# EAGLE design Motor_board_2_5 (EAGLE 9.0.0)
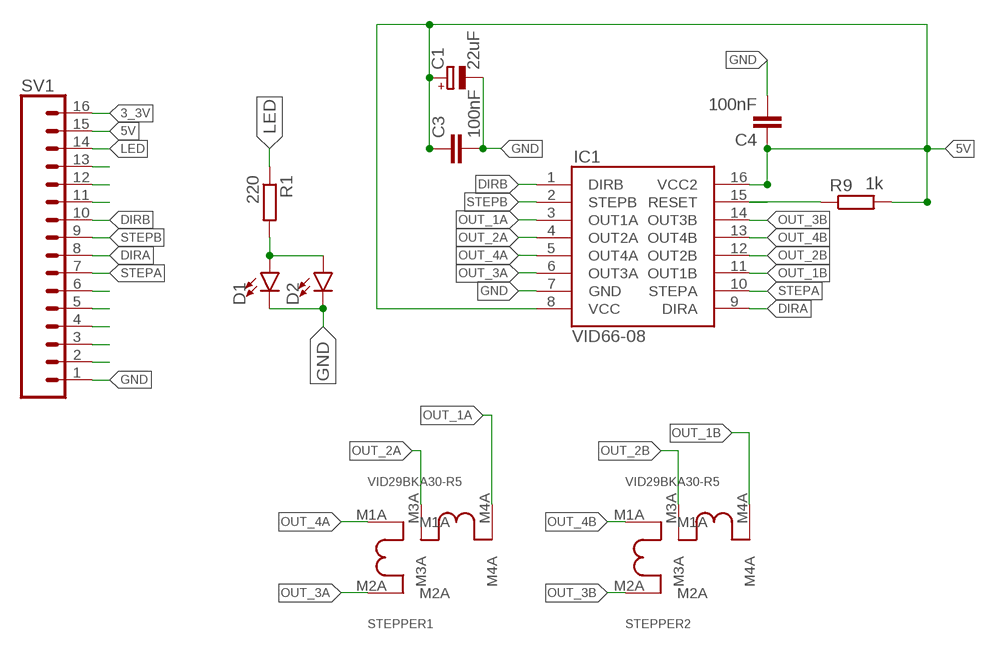
[diagram p0: schematic, sheet 1]

## Parts
C1  22uF  CPOL-EU153CLV-0605  [153CLV-0605]
C3  100nF  C-EUC1206K  [C1206K]
C4  100nF  C-EUC1206K  [C1206K]
D1  LED-3MM-NO_SILK  [LED_3MM-NS]
D2  LED-3MM-NO_SILK  [LED_3MM-NS]
IC1  VID66-08  [SO16]
R1  220  R-EU_0204/7  [0204/7]
R9  1k  R-EU_M0805  [M0805]
STEPPER1  VID29BKA30-R5  [BKA30-R5]
STEPPER2  VID29BKA30-R5  [BKA30-R5]
SV1  CONN_16  [1X16]

## Nets
3_3V: SV1.16
5V [5V]: C1.+ C3.1 C4.1 IC1.8(VCC) IC1.16(VCC2) R9.2 SV1.15
DIRA: IC1.9(DIRA) SV1.8
DIRB: IC1.1(DIRB) SV1.10
GND [GND]: C1.- C3.2 C4.2 D1.K(C) D2.K(C) IC1.7(GND) SV1.1
LED [LED]: R1.1 SV1.14
N$1: D1.A D2.A R1.2
N$4: SV1.3
N$5: SV1.2
N$6: SV1.11
N$7: SV1.12
N$8: SV1.13
N$9: SV1.5
N$10: SV1.4
N$11: SV1.6
N$15: IC1.15(RESET) R9.1
OUT_1A: IC1.3(OUT1A) STEPPER1.M4A
OUT_1B: IC1.11(OUT1B) STEPPER2.M4A
OUT_2A: IC1.4(OUT2A) STEPPER1.M3A
OUT_2B: IC1.12(OUT2B) STEPPER2.M3A
OUT_3A: IC1.6(OUT3A) STEPPER1.M2A
OUT_3B: IC1.14(OUT3B) STEPPER2.M2A
OUT_4A: IC1.5(OUT4A) STEPPER1.M1A
OUT_4B: IC1.13(OUT4B) STEPPER2.M1A
STEPA: IC1.10(STEPA) SV1.7
STEPB: IC1.2(STEPB) SV1.9

## Library data of the parts
C1 = rcl:CPOL-EU: POLARIZED CAPACITOR, European symbol; SPICEPREFIX: C
C3 C4 = rcl:C-EU: CAPACITOR, European symbol; SPICEPREFIX: C
D1 D2 = SparkFun-LED:LED: LED (Generic) Standard schematic elements and footprints for 5mm, 3mm, 1206, and 0603 sized LEDs. Generic LEDs with no color specified.
IC1 = Franks:VID66-08
R1 R9 = resistor:R-EU_: RESISTOR, European symbol
STEPPER1 STEPPER2 = Franks:VID29
SV1 = SparkFun-Connectors:CONN_16: Multi connection point. Often used as Generic Header-pin footprint for 0.1 inch spaced/style header connections On any of the 0.1 inch spaced packages, you can populate with these: Break Away Headers - Straight <https://www.sparkfun.com/products/116> (PRT-00116) Break Away Male Headers - Right Angle <https://www.sparkfun.com/products/553> (PRT-00553) Female Headers <https://www.sparkfun.com/products/115> (PRT-00115) Break Away Headers - Machine Pin <https://www.sparkfun.com/products/117> (PRT-00117) Break Away Female Headers - Swiss Machine Pin <https://www.sparkfun.com/products/743> (PRT-00743) For SCREWTERMINALS and SPRING TERMINALS visit here: Screw Terimnals on SparkFun.com <https://www.sparkfun.com/search/results?term=Screw+Terminals> (5mm/3.5mm/2.54mm spacing) This device is also useful as a general connection point to wire up your design to another part of your project. Our various solder wires solder well into these plated through hole pads. Hook-Up Wire - Assortment (Stranded, 22 AWG) <https://www.sparkfun.com/products/11375> (PRT-11375) Hook-Up Wire - Assortment (Solid Core, 22 AWG) <https://www.sparkfun.com/products/11367> (PRT-11367) View the entire wire category on our website here <https://www.sparkfun.com/categories/141> Special notes: Molex polarized connector foot print use with SKU : PRT-08231 with associated crimp pins and housings. 1MM SMD Version SKU: PRT-10208 NOTES ON THE VARIANTS LOCK and LOCK_LONGPADS... This footprint was designed to help hold the alignment of a through-hole component (i.e. 6-pin header) while soldering it into place. You may notice that each hole has been shifted either up or down by 0.005 of an inch from it's more standard position (which is a perfectly straight line). This slight alteration caused the pins (the squares in the middle) to touch the edges of the holes. Because they are alternating, it causes a "brace" to hold the component in place. 0.005 has proven to be the perfect amount of "off-center" position when using our standard breakaway headers. Although looks a little odd when you look at the bare footprint, once you have a header in there, the alteration is very hard to notice. Also,if you push a header all the way into place, it is covered up entirely on the bottom side.

## Net classes
0 default: width 0.203 mm
1 GND: width 0.762 mm, clearance 0.254 mm
3 LED: width 0.508 mm
4 5V: width 0.508 mm

## Board
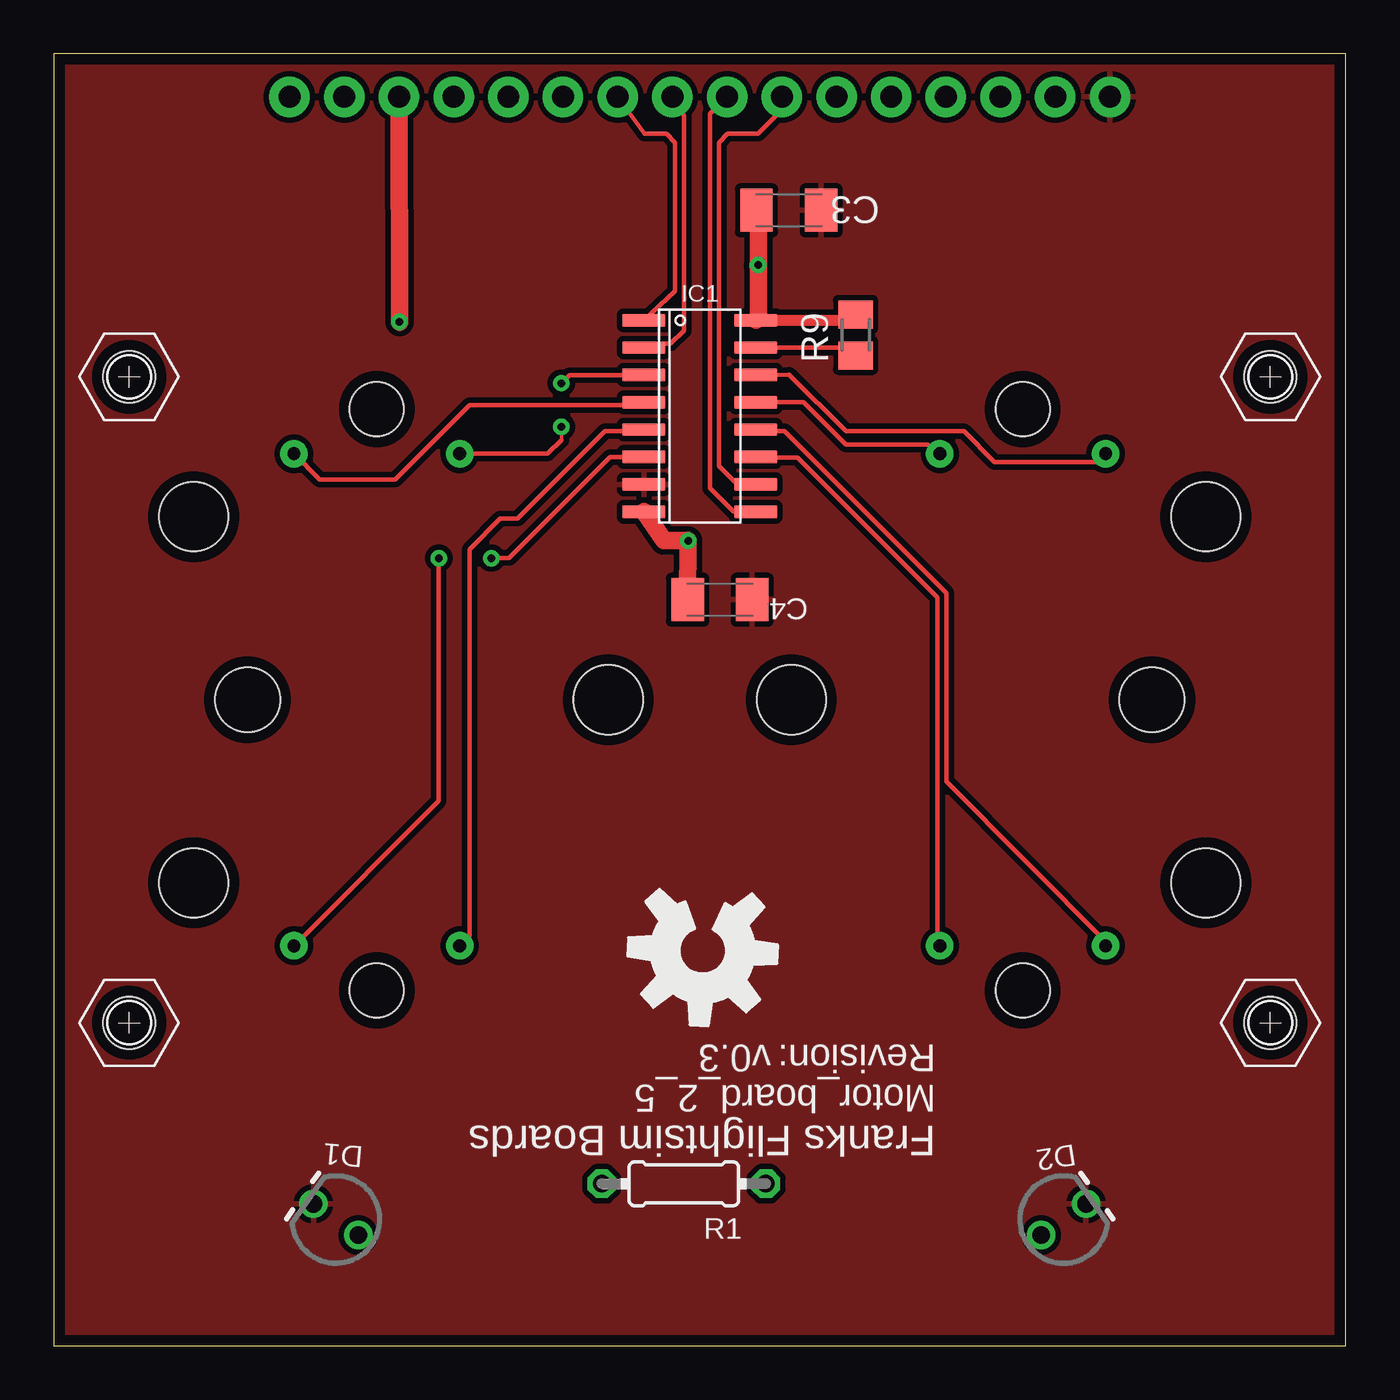
[diagram p1: board, top side]
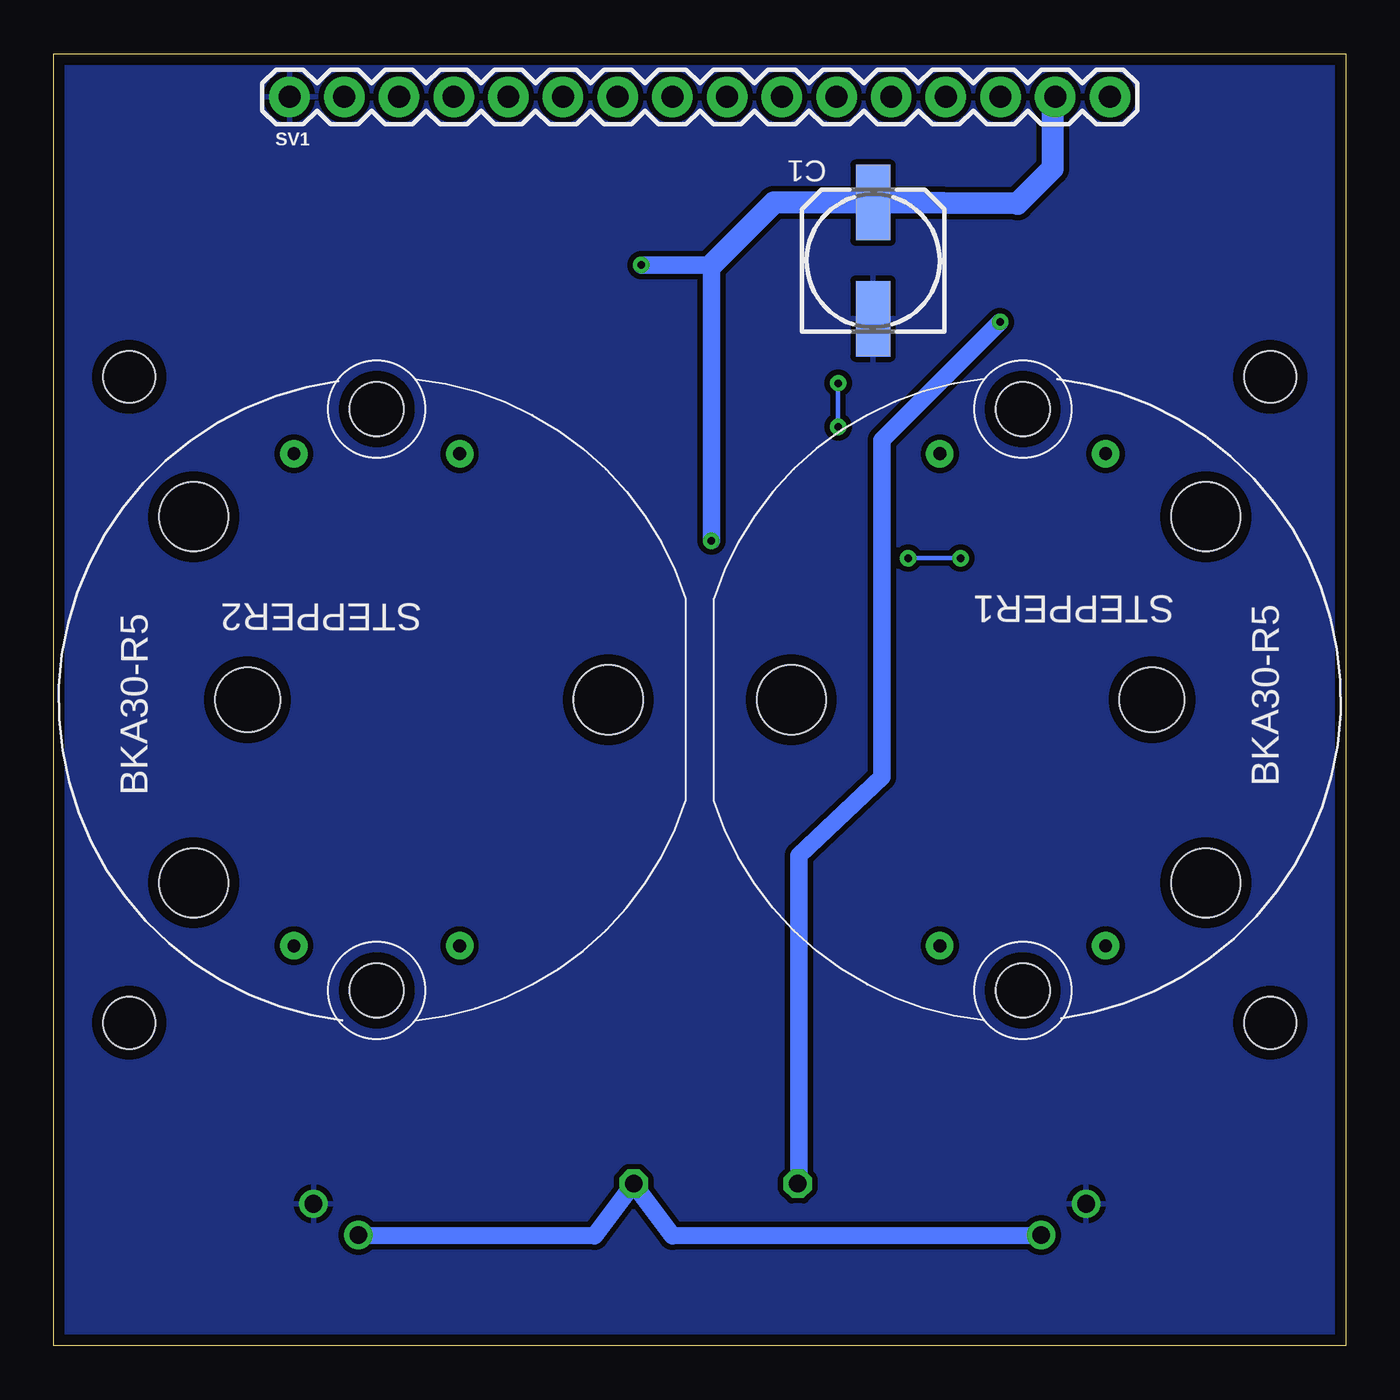
[diagram p2: board, bottom side, seen from below]

Size 60 x 60 mm. Coordinates in mm from the lower left corner, seen from the top.
Outline: 0,0 60,0 60,60 0,60 0,0
Copper layers (1*16): Top 0.035mm / dielectric 1.5mm / Bottom 0.035mm
Design rules "default *": minimum track width 6mil, minimum drill 0.35mm, track to track 6mil, track to pad 6mil, pad to pad 6mil, via to via 6mil, smd to smd 6mil, copper to edge 20mil, drill to drill 6mil, minimum pad ring 10mil, minimum via ring 8mil, stop-mask expansion 4mil, vias tented up to drill 0mil, thermal gap 10mil

### Footprints (pad centres in the part's own frame; a part is rotated, then mirrored left to right if it is on the bottom)
153CLV-0605 = smd 3.5 x 1.6: + 2.7,0; - -2.7,0
C1206K = smd 1.5 x 2: 1 -1.5,0; 2 1.5,0
LED_3MM-NS = drill 0.813: A -1.27,0; K 1.27,0
SO16 = smd 2 x 0.6: 1 -2.6,4.445; 2 -2.6,3.175; 3 -2.6,1.905; 4 -2.6,0.635; 5 -2.6,-0.635; 6 -2.6,-1.905; 7 -2.6,-3.175; 8 -2.6,-4.445; 9 2.6,-4.445; 10 2.6,-3.175; 11 2.6,-1.905; 12 2.6,-0.635; 13 2.6,0.635; 14 2.6,1.905; 15 2.6,3.175; 16 2.6,4.445
0204/7 = drill 0.813 octagon: 1 -3.81,0; 2 3.81,0
M0805 = smd 1.3 x 1.6: 1 -0.95,0; 2 0.95,0
BKA30-R5 = drill 0.6 pad 1.27: M1A -11.425,9.85; M2A -11.425,2.15; M3A 11.425,2.15; M4A 11.425,9.85 | hole 2.5: 13.5,6; -13.5,6 | hole 3: 0,0 | hole 3.2: 0,16.75; 8.5,-2.5; -8.5,-2.5
1X16 = drill 1.016 pad 1.88: 1 0,0; 2 2.54,0; 3 5.08,0; 4 7.62,0; 5 10.16,0; 6 12.7,0; 7 15.24,0; 8 17.78,0; 9 20.32,0; 10 22.86,0; 11 25.4,0; 12 27.94,0; 13 30.48,0; 14 33.02,0; 15 35.56,0; 16 38.1,0
M2.0_SW4.0_HOLE = hole 2.4: 0,0

### Placement (x,y rotation side)
C1  21.95,50.39 90 bottom
C3  34.14,52.73 0 top
C4  30.94,34.65 0 top
D1  13.1,5.86 145 top
D2  46.9,5.86 35 top
IC1  30,43.18 0 top
R1  29.26,7.52 0 top
R9  37.24,46.94 90 top
STEPPER1  9,30 90 bottom
STEPPER2  51,30 270 bottom
SV1  49.05,58 0 bottom
U$1  [M2.0_SW4.0_HOLE]  3.5,45 0 top
U$2  [M2.0_SW4.0_HOLE]  3.5,15 0 top
U$3  [M2.0_SW4.0_HOLE]  56.5,45 0 top
U$4  [M2.0_SW4.0_HOLE]  56.5,15 0 top
U$9  [OSHW-LOGO-L]  30.14,18.35 177.2 top

### Tracks (layer width: path | path; a pad name or v marks a point on that pad's centre or on a via)
5V  (via drill 0.35)
  Top 0.508: R9.2 37.2,47.91 | 37.2,47.91 36.78,48.16 | IC1.16 36.91,47.62 37.2,47.91
  Top 0.813: IC1.16 32.73,47.75 32.73,49.99 | 32.73,49.99 v32.72,50.19 | IC1.8 28.34,37.39 v29.46,37.39 C4.1 | C3.1 32.73,51.8 32.73,49.99
  Bottom 0.813: v29.46,37.39 29.46,50.19 v32.72,50.19
  Bottom 1.016: SV1.15 13.61,57.51 13.61,54.66 15.24,53.03 C1.+ 26.56,53.09 29.46,50.19
DIRA
  Top 0.203: IC1.9 31.57,38.73 30.48,39.83 30.48,57.21 SV1.8
DIRB
  Top 0.203: IC1.1 28.85,48.97 28.85,55.88 28.45,56.29 27.43,56.29 SV1.10
GND
  pour Top: 0,0 0.2,59.94 60.15,59.94 59.94,0
  pour Bottom: 0.41,59.54 59.74,59.54 59.74,0.2 0.2,0.41
LED  (via drill 0.35)
  Top 0.813: SV1.14 v16.05,47.55
  Bottom 0.508: 25.4,7.57 R1.1
  Bottom 0.813: v16.05,47.55 21.54,42.06 21.54,26.42 25.4,22.76 25.4,7.57
N$1
  Bottom 0.813: D2.A 34.88,5.1 R1.2 31.26,5.1 D1.A
N$15
  Top 0.203: IC1.15 37.23,46.35 R9.1
OUT_1A  (via drill 0.35)
  Top 0.152: 23.57,42.06 v23.57,42.67
  Top 0.203: STEPPER1.M4A 22.93,41.42 23.57,42.06 | v23.57,44.7 23.95,45.09 IC1.3
  Bottom 0.203: v23.57,42.67 v23.57,44.7
OUT_1B
  Top 0.203: IC1.11 32.62,41.25 34.54,41.25 41.05,34.75 41.05,18.9 STEPPER2.M4A
OUT_2A
  Top 0.203: IC1.4 26.42,43.69 19.3,43.69 15.85,40.23 12.34,40.23 STEPPER1.M3A
OUT_2B
  Top 0.203: IC1.12 33.53,42.47 33.93,42.47 41.45,34.95 41.45,26.21 48.88,18.73 STEPPER2.M3A
OUT_3A  (via drill 0.35)
  Top 0.203: IC1.6 25.83,41.27 21.13,36.58 v20.32,36.58 | v17.88,36.58 17.88,25.31 STEPPER1.M2A
  Bottom 0.203: v20.32,36.58 v17.88,36.58
OUT_3B
  Top 0.203: IC1.14 34.14,45.11 36.78,42.47 42.27,42.47 43.69,41.05 48.36,41.05 STEPPER2.M2A
OUT_4A
  Top 0.203: IC1.5 27.32,42.47 25.6,42.47 21.54,38.41 20.73,38.41 19.3,36.98 19.3,19.03 STEPPER1.M1A
OUT_4B
  Top 0.203: IC1.13 34.82,43.81 36.78,41.86 40.6,41.86 STEPPER2.M1A
STEPA
  Top 0.203: IC1.10 32.58,40.03 31.7,40.03 30.89,40.84 30.89,55.88 31.29,56.29 32.72,56.29 33.73,57.3 33.73,57.92 SV1.7
STEPB
  Top 0.203: SV1.9 29.17,57.39 29.26,57.1 29.26,47.14 28.65,46.53 28.25,46.53 IC1.2

### Text on the board
tNames: Revision: